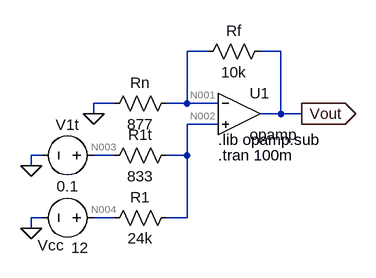
[diagram p0: schematic opamp_alg4.asc]
opamp_alg4.asc, the LTspice schematic file:
Version 4.1
SHEET 1 880 680
WIRE 176 48 144 48
WIRE 288 48 256 48
WIRE 32 128 0 128
WIRE 144 128 144 48
WIRE 144 128 112 128
WIRE 192 128 144 128
WIRE 0 144 0 128
WIRE 288 144 288 48
WIRE 288 144 256 144
WIRE 320 144 288 144
WIRE 192 160 144 160
WIRE -80 208 -96 208
WIRE 32 208 0 208
WIRE 144 208 144 160
WIRE 144 208 112 208
WIRE -96 224 -96 208
WIRE -80 304 -96 304
WIRE 32 304 0 304
WIRE 144 304 144 208
WIRE 144 304 112 304
WIRE -96 320 -96 304
FLAG 320 144 Vout
IOPIN 320 144 Out
FLAG 0 144 0
FLAG -96 224 0
FLAG -96 320 0
SYMBOL OpAmps\\opamp 224 80 R0
SYMATTR InstName U1
SYMBOL res 272 32 R90
WINDOW 0 0 56 VBottom 2
WINDOW 3 32 56 VTop 2
SYMATTR InstName Rf
SYMATTR Value 10k
SYMBOL res 128 112 R90
WINDOW 0 0 56 VBottom 2
WINDOW 3 32 56 VTop 2
SYMATTR InstName Rn
SYMATTR Value 877
SYMBOL res 128 288 R90
WINDOW 0 0 56 VBottom 2
WINDOW 3 32 56 VTop 2
SYMATTR InstName R1
SYMATTR Value 24k
SYMBOL res 128 192 R90
WINDOW 0 0 56 VBottom 2
WINDOW 3 32 56 VTop 2
SYMATTR InstName R1t
SYMATTR Value 833
SYMBOL voltage 16 208 R90
WINDOW 0 -32 56 VBottom 2
WINDOW 3 32 56 VTop 2
SYMATTR InstName V1t
SYMATTR Value 0.1
SYMBOL voltage 16 304 R90
WINDOW 0 58 82 VBottom 2
WINDOW 3 30 37 VTop 2
SYMATTR InstName Vcc
SYMATTR Value 12
TEXT 192 184 Left 2 !.lib opamp.sub
TEXT 192 208 Left 2 !.tran 100m

The netlist it stands for:
* opamp_alg4.asc
X§U1 N001 N002 Vout opamp Aol=100K GBW=10Meg  ; pins invin noninvin out
Rf Vout N001 10k
Rn N001 0 877
R1 N002 N004 24k
R1t N002 N003 833
V1t N003 0 0.1
Vcc N004 0 12
.lib opamp.sub
.tran 100m
.backanno
.end

* Results of the author's LTspice run, read from the files saved beside the schematic
* Operating Point, zero values left out:
*   V(n001) = 499.1 mV
*   V(n002) = 499.2 mV
*   V(n003) = 100 mV
*   V(n004) = 12 V
*   V(vout) = 6.19 V
*   I(R1) = -479.2 µA
*   I(R1t) = 479.2 µA
*   I(Rf) = 569.1 µA
*   I(Rn) = 569.1 µA
*   I(V1t) = 479.2 µA
*   I(Vcc) = -479.2 µA
*   Ix(u1:3) = -569.1 µA